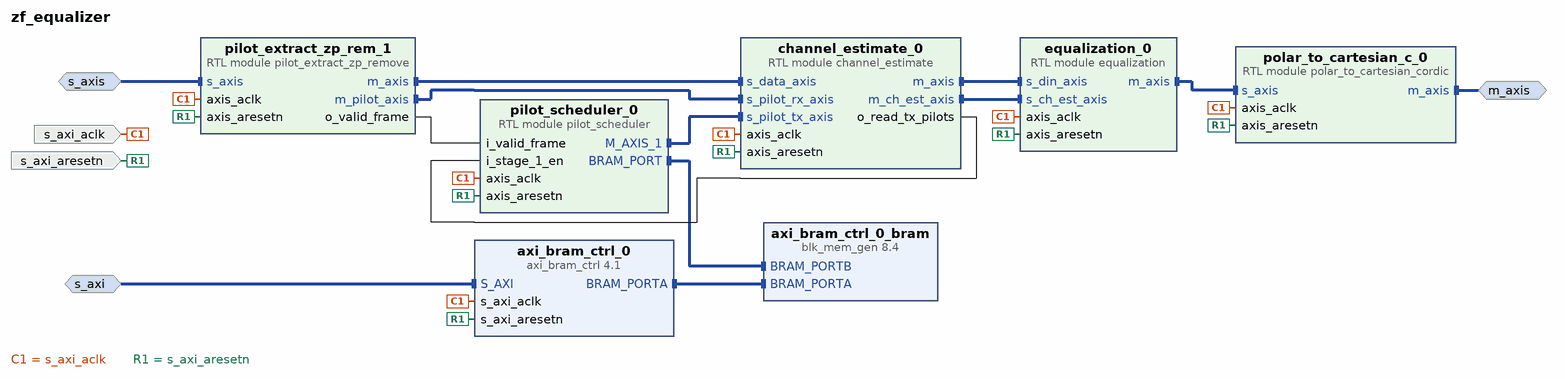
[diagram p0: block diagram of the top level]
# Vivado block design zf_equalizer, xczu28dr-ffvg1517-2-e, Vivado 2022.1
create_bd_design zf_equalizer

create_bd_intf_port -mode Slave -vlnv xilinx.com:interface:aximm_rtl:1.0 s_axi
set_property -dict [list \
  CONFIG.ADDR_WIDTH 15 \
  CONFIG.ARUSER_WIDTH 0 \
  CONFIG.AWUSER_WIDTH 0 \
  CONFIG.BUSER_WIDTH 0 \
  CONFIG.DATA_WIDTH 32 \
  CONFIG.FREQ_HZ 92160000 \
  CONFIG.HAS_BRESP 1 \
  CONFIG.HAS_BURST 1 \
  CONFIG.HAS_CACHE 1 \
  CONFIG.HAS_LOCK 1 \
  CONFIG.HAS_PROT 1 \
  CONFIG.HAS_QOS 0 \
  CONFIG.HAS_REGION 0 \
  CONFIG.HAS_RRESP 1 \
  CONFIG.HAS_WSTRB 1 \
  CONFIG.ID_WIDTH 0 \
  CONFIG.MAX_BURST_LENGTH 256 \
  CONFIG.NUM_READ_OUTSTANDING 2 \
  CONFIG.NUM_READ_THREADS 1 \
  CONFIG.NUM_WRITE_OUTSTANDING 2 \
  CONFIG.NUM_WRITE_THREADS 1 \
  CONFIG.PROTOCOL AXI4 \
  CONFIG.READ_WRITE_MODE READ_WRITE \
  CONFIG.RUSER_BITS_PER_BYTE 0 \
  CONFIG.RUSER_WIDTH 0 \
  CONFIG.SUPPORTS_NARROW_BURST 1 \
  CONFIG.WUSER_BITS_PER_BYTE 0 \
  CONFIG.WUSER_WIDTH 0 \
] [get_bd_intf_ports s_axi]
create_bd_intf_port -mode Slave -vlnv xilinx.com:interface:axis_rtl:1.0 s_axis
set_property -dict [list \
  CONFIG.FREQ_HZ 92160000 \
  CONFIG.HAS_TKEEP 0 \
  CONFIG.HAS_TLAST 1 \
  CONFIG.HAS_TREADY 0 \
  CONFIG.HAS_TSTRB 0 \
  CONFIG.LAYERED_METADATA undef \
  CONFIG.TDATA_NUM_BYTES 16 \
  CONFIG.TDEST_WIDTH 0 \
  CONFIG.TID_WIDTH 0 \
  CONFIG.TUSER_WIDTH 0 \
] [get_bd_intf_ports s_axis]
create_bd_intf_port -mode Master -vlnv xilinx.com:interface:axis_rtl:1.0 m_axis
set_property -dict {CONFIG.FREQ_HZ 92160000} [get_bd_intf_ports m_axis]
create_bd_port -dir I -type clk s_axi_aclk
set_property -dict {CONFIG.FREQ_HZ 92160000} [get_bd_ports s_axi_aclk]
create_bd_port -dir I -type rst s_axi_aresetn

create_bd_cell -type module -reference pilot_scheduler pilot_scheduler_0
create_bd_cell -type module -reference polar_to_cartesian_cordic polar_to_cartesian_c_0
create_bd_cell -type module -reference equalization equalization_0
create_bd_cell -type module -reference channel_estimate channel_estimate_0
create_bd_cell -type module -reference pilot_extract_zp_remove pilot_extract_zp_rem_1
create_bd_cell -type ip -vlnv xilinx.com:ip:axi_bram_ctrl:4.1 axi_bram_ctrl_0
set_property -dict {CONFIG.SINGLE_PORT_BRAM 1} [get_bd_cells axi_bram_ctrl_0]
create_bd_cell -type ip -vlnv xilinx.com:ip:blk_mem_gen:8.4 axi_bram_ctrl_0_bram
set_property -dict [list \
  CONFIG.Coe_File ../../../../new/bram_pilot_init.coe \
  CONFIG.Enable_32bit_Address false \
  CONFIG.Enable_B Use_ENB_Pin \
  CONFIG.Fill_Remaining_Memory_Locations true \
  CONFIG.Load_Init_File true \
  CONFIG.Memory_Type True_Dual_Port_RAM \
  CONFIG.Port_B_Clock 100 \
  CONFIG.Port_B_Enable_Rate 100 \
  CONFIG.Port_B_Write_Rate 50 \
  CONFIG.Register_PortA_Output_of_Memory_Primitives true \
  CONFIG.Register_PortB_Output_of_Memory_Primitives true \
  CONFIG.Use_Byte_Write_Enable false \
  CONFIG.Use_RSTA_Pin false \
  CONFIG.Use_RSTB_Pin false \
  CONFIG.Write_Depth_A 10240 \
  CONFIG.use_bram_block Stand_Alone \
] [get_bd_cells axi_bram_ctrl_0_bram]

# ---- connections ----

connect_bd_intf_net [get_bd_intf_pins axi_bram_ctrl_0_bram/BRAM_PORTA] [get_bd_intf_pins axi_bram_ctrl_0/BRAM_PORTA]
connect_bd_intf_net [get_bd_intf_pins channel_estimate_0/m_axis] [get_bd_intf_pins equalization_0/s_din_axis]
connect_bd_intf_net [get_bd_intf_pins channel_estimate_0/m_ch_est_axis] [get_bd_intf_pins equalization_0/s_ch_est_axis]
connect_bd_intf_net [get_bd_intf_pins equalization_0/m_axis] [get_bd_intf_pins polar_to_cartesian_c_0/s_axis]
connect_bd_intf_net [get_bd_intf_pins pilot_extract_zp_rem_1/m_axis] [get_bd_intf_pins channel_estimate_0/s_data_axis]
connect_bd_intf_net [get_bd_intf_pins pilot_extract_zp_rem_1/m_pilot_axis] [get_bd_intf_pins channel_estimate_0/s_pilot_rx_axis]
connect_bd_intf_net [get_bd_intf_pins pilot_scheduler_0/BRAM_PORT] [get_bd_intf_pins axi_bram_ctrl_0_bram/BRAM_PORTB]
connect_bd_intf_net [get_bd_intf_pins pilot_scheduler_0/M_AXIS_1] [get_bd_intf_pins channel_estimate_0/s_pilot_tx_axis]
connect_bd_intf_net [get_bd_intf_ports m_axis] [get_bd_intf_pins polar_to_cartesian_c_0/m_axis]
connect_bd_intf_net [get_bd_intf_ports s_axi] [get_bd_intf_pins axi_bram_ctrl_0/S_AXI]
connect_bd_intf_net [get_bd_intf_ports s_axis] [get_bd_intf_pins pilot_extract_zp_rem_1/s_axis]
connect_bd_net [get_bd_pins channel_estimate_0/o_read_tx_pilots] [get_bd_pins pilot_scheduler_0/i_stage_1_en]
connect_bd_net [get_bd_pins pilot_extract_zp_rem_1/o_valid_frame] [get_bd_pins pilot_scheduler_0/i_valid_frame]
connect_bd_net [get_bd_ports s_axi_aclk] \
  [get_bd_pins pilot_scheduler_0/axis_aclk] [get_bd_pins polar_to_cartesian_c_0/axis_aclk] \
  [get_bd_pins equalization_0/axis_aclk] [get_bd_pins channel_estimate_0/axis_aclk] \
  [get_bd_pins pilot_extract_zp_rem_1/axis_aclk] [get_bd_pins axi_bram_ctrl_0/s_axi_aclk]
connect_bd_net [get_bd_ports s_axi_aresetn] \
  [get_bd_pins pilot_scheduler_0/axis_aresetn] [get_bd_pins polar_to_cartesian_c_0/axis_aresetn] \
  [get_bd_pins equalization_0/axis_aresetn] [get_bd_pins channel_estimate_0/axis_aresetn] \
  [get_bd_pins pilot_extract_zp_rem_1/axis_aresetn] [get_bd_pins axi_bram_ctrl_0/s_axi_aresetn]

# ---- address map ----
assign_bd_address -offset 0x0000 -range 4K -target_address_space [get_bd_addr_spaces s_axi] [get_bd_addr_segs axi_bram_ctrl_0/S_AXI/Mem0]

validate_bd_design
save_bd_design
